# EAGLE schematic controller-c0m0 (EAGLE 9.0.0)

## Sheet 1 of 2
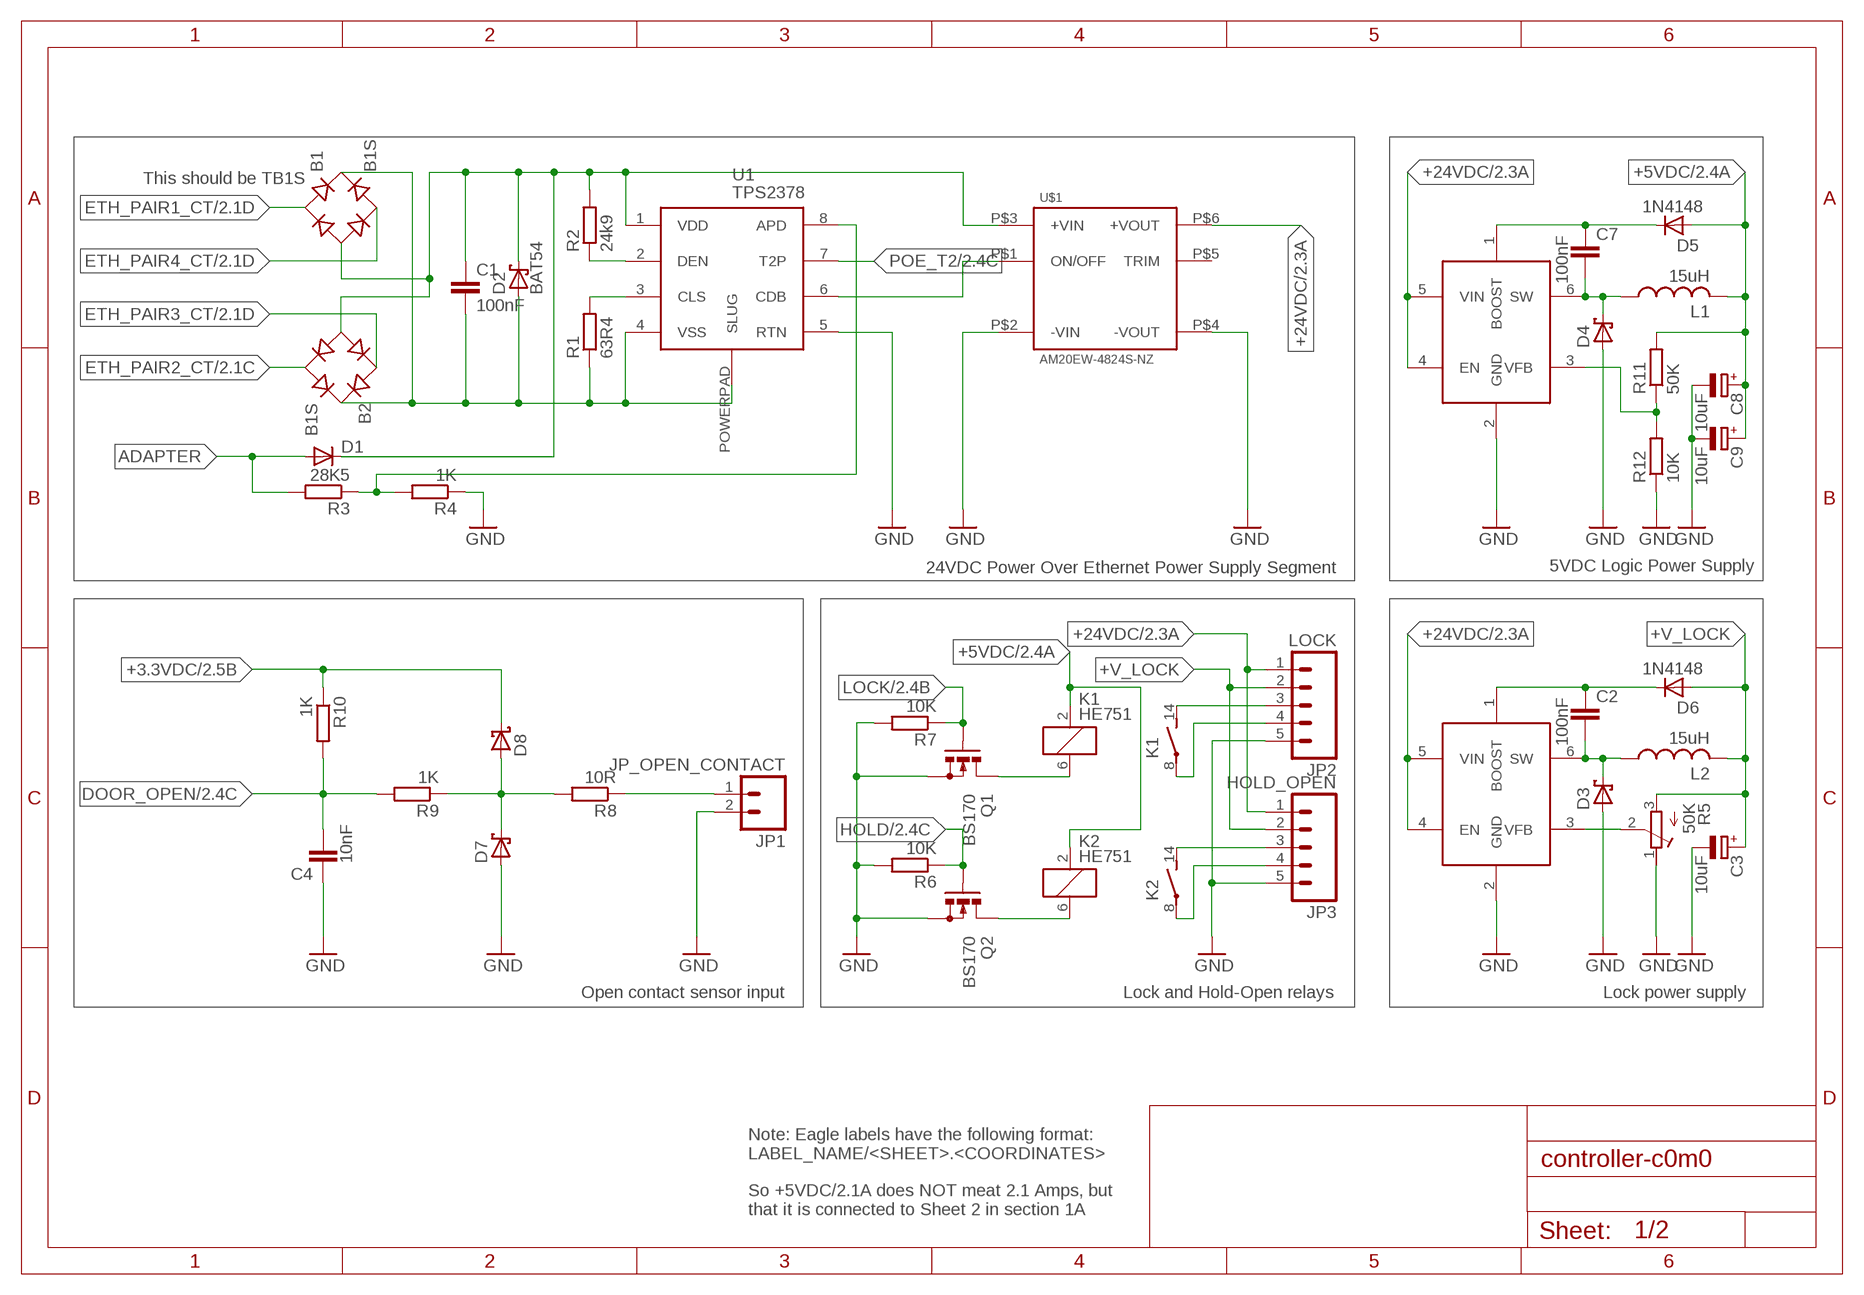
[diagram p0: schematic, sheet 1]

### Parts
B1  B1S  [MBS]
B2  B1S  [MBS]
C1  100nF  C  [C0805]
C2  100nF  C-EUC0805  [C0805]
C3  10uF  CPOL-EUA/3216-18R  [A/3216-18R]
C4  10nF  C-EUC0805  [C0805]
C7  100nF  C-EUC0805  [C0805]
C8  10uF  CPOL-EUA/3216-18R  [A/3216-18R]
C9  10uF  CPOL-EUA/3216-18R  [A/3216-18R]
D1  DIODE-SOD323-W  [SOD323-W]
D2  BAT54  [SOT23]
D3  BAT60J  [SOD323_ST]
D4  BAT60J  [SOD323_ST]
D5  1N4148  DIODE-SOD323-W  [SOD323-W]
D6  1N4148  DIODE-SOD323-W  [SOD323-W]
D7  BAT60J  [SOD323_ST]
D8  BAT60J  [SOD323_ST]
IC1  MCP16301/H  [SOT23-6]
IC3  MCP16301/H  [SOT23-6]
JP1  JP_OPEN_CONTACT  M02LOCK_LONGPADS  [1X02_LOCK_LONGPADS]
JP2  LOCK  M05PTH_LONGPADS  [1X05_LONGPADS]
JP3  HOLD_OPEN  M05PTH_LONGPADS  [1X05_LONGPADS]
K1  HE751  [HE751]
K2  HE751  [HE751]
L1  15uH  L-USPIS2816  [PIS2816]
L2  15uH  L-USPIS2816  [PIS2816]
Q1  BS170  [SOT54E]
Q2  BS170  [SOT54E]
R1  63R4  R  [R0805]
R2  24k9  R  [R0805]
R3  28K5  R  [R0805]
R4  1K  R  [R0805]
R5  50K  R-TRIMM3314G  [RTRIM3314G]
R6  10K  R  [R0805]
R7  10K  R  [R0805]
R8  10R  R-EU_R0805  [R0805]
R9  1K  R-EU_R0805  [R0805]
R10  1K  R-EU_R0805  [R0805]
R11  50K  R-EU_R0805  [R0805]
R12  10K  R-EU_R0805  [R0805]
U1  TPS2378  [SO08-POWERPAD]
U$1  AM20EW-4824S-NZ  [AM20NW-NZ]

### Nets
+3.3VDC: D8.C R10.1 ; also sheet 2
+5VDC: C8.+ C9.+ D5.A K1.2 K2.2 L1.2 R11.2 ; also sheet 2
+24VDC: IC1.4(EN) IC1.5(VIN) IC3.4(EN) IC3.5(VIN) JP2.1 JP3.1 U$1.P$6(+VOUT) ; also sheet 2
+V_LOCK: C3.+ D6.A JP2.2 JP3.2 L2.2 R5.3(A)
ADAPTER: D1.A R3.2
DOOR_OPEN: C4.2 R9.2 R10.2 ; also sheet 2
ETH_PAIR1_CT: B1.AC1 ; also sheet 2
ETH_PAIR2_CT: B2.AC2 ; also sheet 2
ETH_PAIR3_CT: B2.AC1 ; also sheet 2
ETH_PAIR4_CT: B1.AC2 ; also sheet 2
GND: C3.- C4.1 C8.- C9.- D3.A D4.A D7.A IC1.2(GND) IC3.2(GND) JP1.2 JP2.5 JP3.5 Q1.S Q2.S R4.1 R5.1(E) R6.2 R7.2 R12.1 U1.5(RTN) U$1.P$2(-VIN) U$1.P$4(-VOUT) ; also sheet 2
HOLD: Q2.G R6.1 ; also sheet 2
LOCK: Q1.G R7.1 ; also sheet 2
N$1: R1.2 U1.3(CLS)
N$2: R2.1 U1.2(DEN)
N$3: U1.6(CDB) U$1.P$1(ON/OFF)
N$4: C2.2 D3.C IC1.6(SW) L2.1
N$5: R3.1 R4.2 U1.8(APD)
N$6: C2.1 D6.C IC1.1(BOOST)
N$7: IC1.3(VFB) R5.2(S)
N$8: JP2.3 K1.14(2:S)
N$9: JP2.4 K1.8(2:P)
N$10: JP3.3 K2.14(2:S)
N$11: JP3.4 K2.8(2:P)
N$12: K1.6 Q1.D
N$13: K2.6 Q2.D
N$14: D7.C D8.A R8.2 R9.1
N$16: JP1.1 R8.1
N$22: C7.2 D4.C IC3.6(SW) L1.1
N$23: C7.1 D5.C IC3.1(BOOST)
N$25: IC3.3(VFB) R11.1 R12.2
POE_T2: U1.7(T2P) ; also sheet 2
V+_POE: B1.- B2.- C1.1 D1.C D2.3(C) R2.2 U1.1(VDD) U$1.P$3(+VIN)
V-_POE: B1.+ B2.+ C1.2 D2.1(A) R1.1 U1.4(VSS) U1.POWERPAD(SLUG)
Unconnected: U$1.P$5(TRIM)

### Notes on the sheet
- This should be TB1S
- 24VDC Power Over Ethernet Power Supply Segment | 5VDC Logic Power Supply
- Open contact sensor input | Lock and Hold-Open relays | Lock power supply
- Note: Eagle labels have the following format:
  LABEL_NAME/<SHEET>.<COORDINATES>
  
  So +5VDC/2.1A does NOT meat 2.1 Amps, but
  that it is connected to Sheet 2 in section 1A

## Sheet 2 of 2
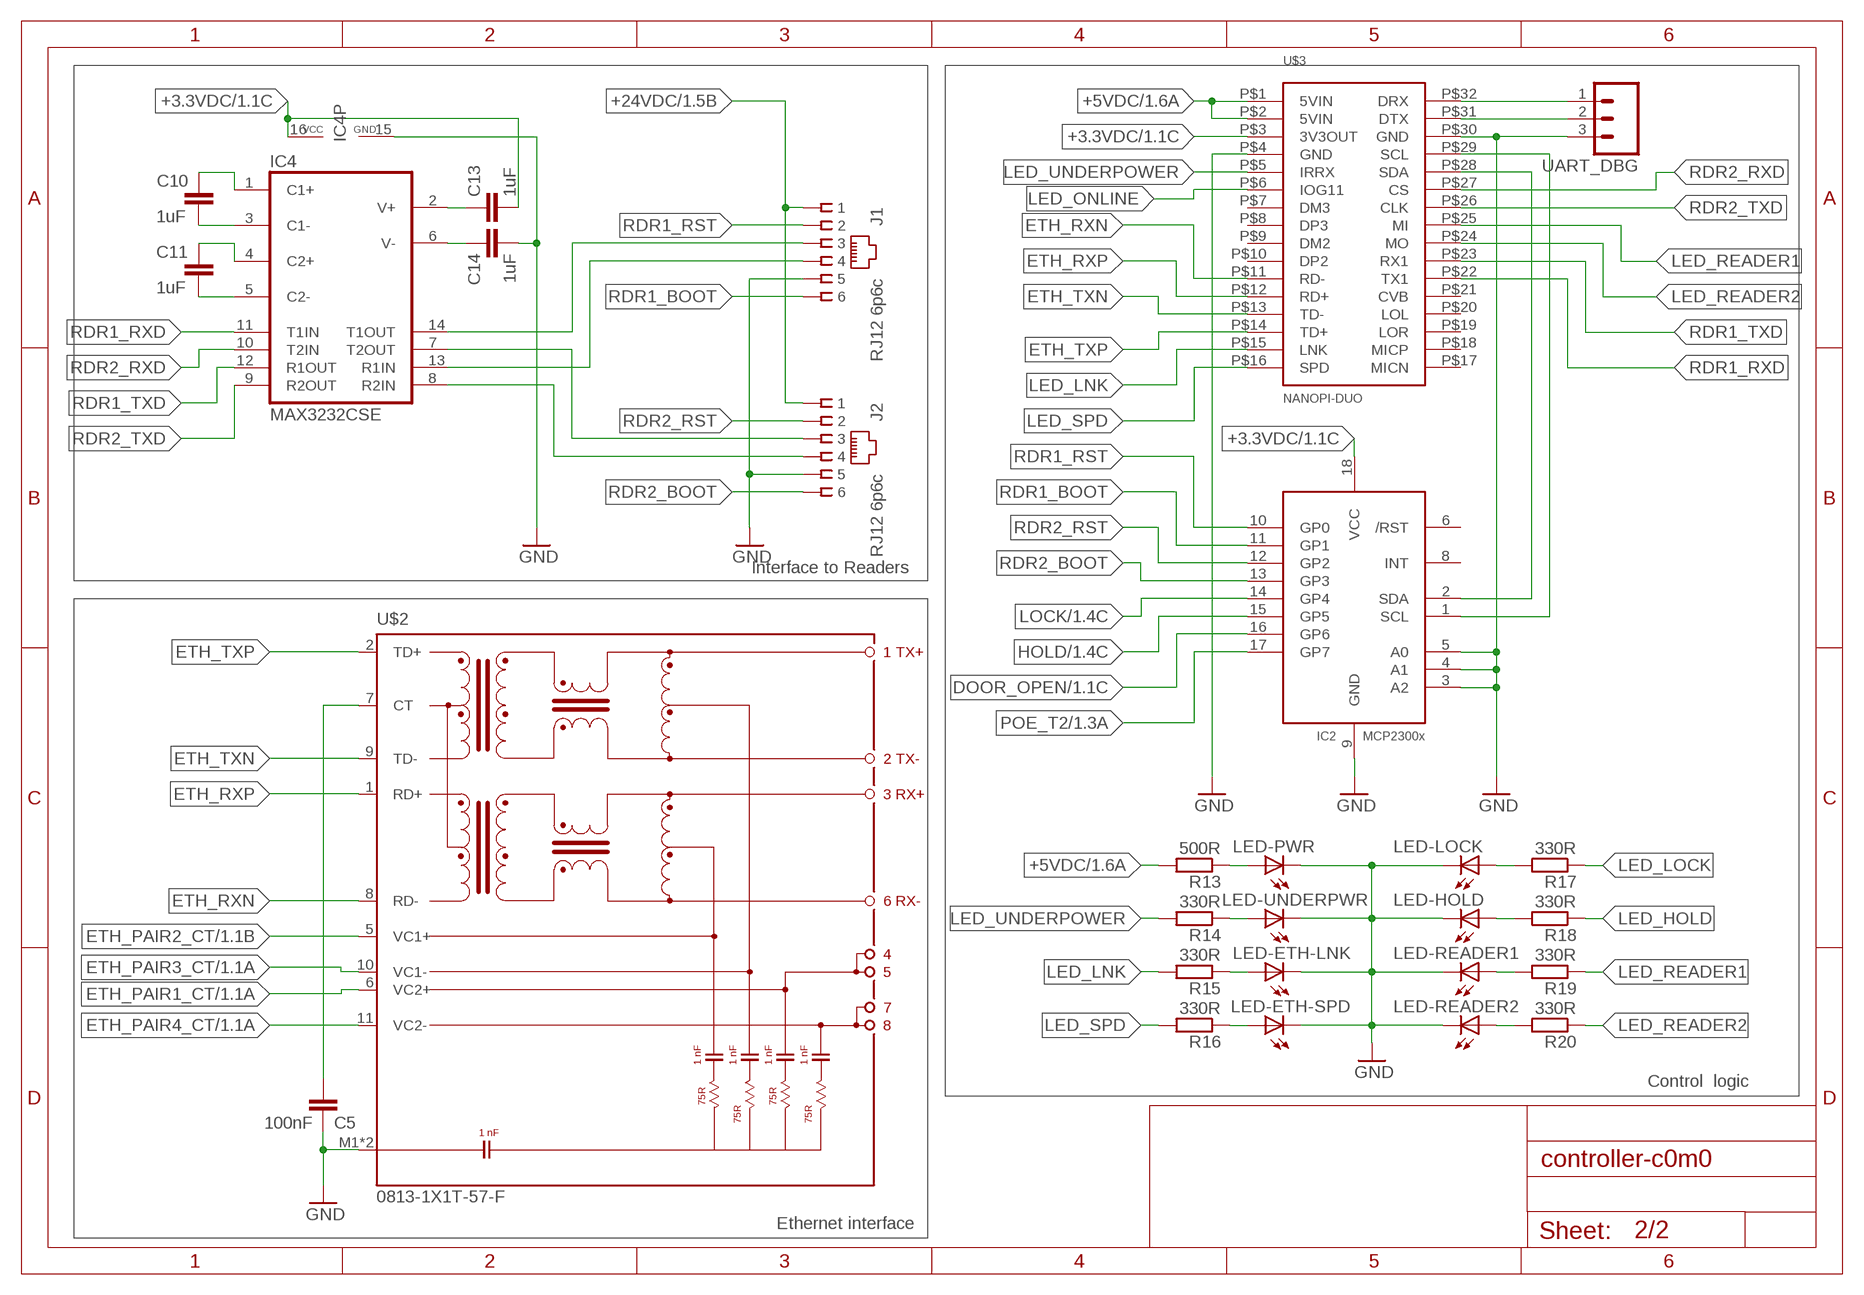
[diagram p1: schematic, sheet 2]

### Parts
C5  100nF  C-EUC0805  [C0805]
C10  1uF  C-EUC0805  [C0805]
C11  1uF  C-EUC0805  [C0805]
C13  1uF  C-EUC0805  [C0805]
C14  1uF  C-EUC0805  [C0805]
IC2  MCP23008/SO  [SO18W]
IC4  MAX3232CSE  [SO16]
J1  RJ12 6p6c  RJ11-2X  [RJ11-NO_SHIELD]
J2  RJ12 6p6c  RJ11-2X  [RJ11-NO_SHIELD]
LED-ETH-LNK  LEDCHIP-LED0805  [CHIP-LED0805]
LED-ETH-SPD  LEDCHIP-LED0805  [CHIP-LED0805]
LED-HOLD  LEDCHIP-LED0805  [CHIP-LED0805]
LED-LOCK  LEDCHIP-LED0805  [CHIP-LED0805]
LED-PWR  LEDCHIP-LED0805  [CHIP-LED0805]
LED-READER1  LEDCHIP-LED0805  [CHIP-LED0805]
LED-READER2  LEDCHIP-LED0805  [CHIP-LED0805]
LED-UNDERPWR  LEDCHIP-LED0805  [CHIP-LED0805]
R13  500R  R  [R0805]
R14  330R  R  [R0805]
R15  330R  R  [R0805]
R16  330R  R  [R0805]
R17  330R  R  [R0805]
R18  330R  R  [R0805]
R19  330R  R  [R0805]
R20  330R  R  [R0805]
U$2  0813-1X1T-57-F  [J1]
U$3  NANOPI-DUO  [NANOPI-DUO]
UART_DBG  M03LONGPADS  [1X03_LONGPADS]

### Nets
+3.3VDC: C13.2 IC2.18(VCC) IC4.16(VCC) U$3.P$3(3V3OUT) ; also sheet 1
+5VDC: R13.2 U$3.P$1(5VIN) U$3.P$2(5VIN) ; also sheet 1
+24VDC: J1.1 J2.1 ; also sheet 1
DOOR_OPEN: IC2.16(GP6) ; also sheet 1
ETH_PAIR1_CT: U$2.6(VC2+) ; also sheet 1
ETH_PAIR2_CT: U$2.5(VC1+) ; also sheet 1
ETH_PAIR3_CT: U$2.10(VC1-) ; also sheet 1
ETH_PAIR4_CT: U$2.11(VC2-) ; also sheet 1
ETH_RXN: U$2.8(RD-) U$3.P$11(RD-)
ETH_RXP: U$2.1(RD+) U$3.P$12(RD+)
ETH_TXN: U$2.9(TD-) U$3.P$13(TD-)
ETH_TXP: U$2.2(TD+) U$3.P$14(TD+)
GND: C5.1 C14.2 IC2.3(A2) IC2.4(A1) IC2.5(A0) IC2.9(GND) IC4.15(GND) J1.5 J2.5 LED-ETH-LNK.C LED-ETH-SPD.C LED-HOLD.C LED-LOCK.C LED-PWR.C LED-READER1.C LED-READER2.C LED-UNDERPWR.C U$2.M1 U$2.M2 U$3.P$4(GND) U$3.P$30(GND) UART_DBG.3 ; also sheet 1
HOLD: IC2.15(GP5) ; also sheet 1
LED_HOLD: R18.1
LED_LNK: R15.2 U$3.P$15(LNK)
LED_LOCK: R17.1
LED_ONLINE: U$3.P$6(IOG11)
LED_READER1: R19.1 U$3.P$25(MI)
LED_READER2: R20.1 U$3.P$24(MO)
LED_SPD: R16.2 U$3.P$16(SPD)
LED_UNDERPOWER: R14.2 U$3.P$5(IRRX)
LOCK: IC2.14(GP4) ; also sheet 1
N$15: IC4.14(T1OUT) J1.3
N$17: IC4.13(R1IN) J1.4
N$18: C10.1 IC4.1(C1+)
N$19: C10.2 IC4.3(C1-)
N$20: C11.1 IC4.4(C2+)
N$21: C11.2 IC4.5(C2-)
N$24: C13.1 IC4.2(V+)
N$26: C14.1 IC4.6(V-)
N$27: IC4.7(T2OUT) J2.3
N$28: C5.2 U$2.7(CT)
N$29: IC4.8(R2IN) J2.4
N$30: IC2.2(SDA) U$3.P$28(SDA)
N$31: IC2.1(SCL) U$3.P$29(SCL)
N$33: U$3.P$31(DTX) UART_DBG.2
N$34: U$3.P$32(DRX) UART_DBG.1
N$38: LED-PWR.A R13.1
N$39: LED-UNDERPWR.A R14.1
N$40: LED-ETH-LNK.A R15.1
N$41: LED-ETH-SPD.A R16.1
N$42: LED-LOCK.A R17.2
N$43: LED-HOLD.A R18.2
N$44: LED-READER1.A R19.2
N$45: LED-READER2.A R20.2
POE_T2: IC2.17(GP7) ; also sheet 1
RDR1_BOOT: IC2.11(GP1) J1.6
RDR1_RST: IC2.10(GP0) J1.2
RDR1_RXD: IC4.11(T1IN) U$3.P$22(TX1)
RDR1_TXD: IC4.12(R1OUT) U$3.P$23(RX1)
RDR2_BOOT: IC2.13(GP3) J2.6
RDR2_RST: IC2.12(GP2) J2.2
RDR2_RXD: IC4.10(T2IN) U$3.P$27(CS)
RDR2_TXD: IC4.9(R2OUT) U$3.P$26(CLK)
Unconnected: IC2.6(/RST) IC2.8(INT) U$3.P$7(DM3) U$3.P$8(DP3) U$3.P$9(DM2) U$3.P$10(DP2) U$3.P$17(MICN) U$3.P$18(MICP) U$3.P$19(LOR) U$3.P$20(LOL) U$3.P$21(CVB)

### Notes on the sheet
- Interface to Readers
- Control  logic
- Ethernet interface

## Library data of the parts
B1 B2 = rectifier:B*S: Surface Mount Glass Passivated Bridge Rectifiers Source: Comchip Bridge Rectifiers B05S-G_B10S-G.pdf
C1 = eagle-ltspice:C: CAPACITOR, European symbol; SPICEMODEL: NONE; SPICEPREFIX: C
C2 C4 C5 C7 C10 C11 C13 C14 = rcl:C-EU: CAPACITOR, European symbol
C3 C8 C9 = rcl:CPOL-EU: POLARIZED CAPACITOR, European symbol
D1 D5 D6 = diode:DIODE-: DIODE
D2 = diode:BAT54: Schottky Diodes Source: Fairchild .. BAT54.pdf
D3 D4 D7 D8 = diode:BAT60J: Schottky barrier diode Source: www.st.com, BAT60J.pdf
IC1 IC3 = MCP16301:MCP16301/H: High-Voltage Input Integrated Switch Step-Down Regulator
IC2 = adafruit:MCP23008: MCP23008 Inexpensive i2c i/o expander - 8 general purpose i/o pins with optional pullups
IC4 = maxim:MAX3232*: True RS-232 Transceivers 3.0V to 5.5V, Low-Power up to 1Mbps, Using Four 0.1µF External Capacitors Source: http://pdfserv.maxim-ic.com/en/ds/MAX3222-MAX3241.pdf; MPN: MAX3232CSE; OC_FARNELL: 9725490; OC_NEWARK: 90C2890
J1 J2 = con-tycoelectronics:RJ11: CORCOM Modular RJ Jacks No Shield Source: www.tycoelectronics.com .. ENG_DS_1654001_1099_RJ_L_0507.pdf; OC_FARNELL: unknown; OC_NEWARK: unknown
JP1 = SparkFun:M02: Header 2 Standard 2-pin 0.1" header. Use with straight break away headers (SKU : PRT-00116), right angle break away headers (PRT-00553), swiss pins (PRT-00743), machine pins (PRT-00117), and female headers (PRT-00115). Molex polarized connector foot print use with SKU : PRT-08233 with associated crimp pins and housings.
JP2 JP3 = SparkFun:M05: Header 5 Standard 5-pin 0.1" header. Use with straight break away headers (SKU : PRT-00116), right angle break away headers (PRT-00553), swiss pins (PRT-00743), machine pins (PRT-00117), and female headers (PRT-00115). Molex polarized connector foot print use with SKU : PRT-08230 with associated crimp pins and housings.
K1 K2 = relay:HE751: RELAY reed, 1 x norm. open, Hamlin; OC_FARNELL: unknown; OC_NEWARK: unknown
L1 L2 = rcl:L-US: INDUCTOR, American symbol
LED-ETH-LNK LED-ETH-SPD LED-HOLD LED-LOCK LED-PWR LED-READER1 LED-READER2 LED-UNDERPWR = adafruit:LED: LED OSRAM: - CHIPLED LG R971, LG N971, LY N971, LG Q971, LY Q971, LO R971, LY R971 LH N974, LH R974 LS Q976, LO Q976, LY Q976 LO Q996 - Hyper CHIPLED LW Q18S LB Q993, LB Q99A, LB R99A - SideLED LS A670, LO A670, LY A670, LG A670, LP A670 LB A673, LV A673, LT A673, LW A673 LH A674 LY A675 LS A676, LA A676, LO A676, LY A676, LW A676 LS A679, LY A679, LG A679 - Hyper Micro SIDELED® LS Y876, LA Y876, LO Y876, LY Y876 LT Y87S - SmartLED LW L88C, LW L88S LB L89C, LB L89S, LG L890 LS L89K, LO L89K, LY L89K LS L896, LA L896, LO L896, LY L896 - TOPLED LS T670, LO T670, LY T670, LG T670, LP T670 LSG T670, LSP T670, LSY T670, LOP T670, LYG T670 LG T671, LOG T671, LSG T671 LB T673, LV T673, LT T673, LW T673 LH T674 LS T676, LA T676, LO T676, LY T676, LB T676, LH T676, LSB T676, LW T676 LB T67C, LV T67C, LT T67C, LS T67K, LO T67K, LY T67K, LW E67C LS E67B, LA E67B, LO E67B, LY E67B, LB E67C, LV E67C, LT E67C LW T67C LS T679, LY T679, LG T679 LS T770, LO T770, LY T770, LG T770, LP T770 LB T773, LV T773, LT T773, LW T773 LH T774 LS E675, LA E675, LY E675, LS T675 LS T776, LA T776, LO T776, LY T776, LB T776 LHGB T686 LT T68C, LB T68C - Hyper Mini TOPLED® LB M676 - Mini TOPLED Santana® LG M470 LS M47K, LO M47K, LY M47K Source: http://www.osram.convergy.de/
Q1 Q2 = transistor-small-signal:BS170: N-CHANNEL MOS FET
R1-R4 R6 R7 R13-R20 = eagle-ltspice:R: RESISTOR, European symbol; SPICEMODEL: NONE; SPICEPREFIX: R
R5 = resistor:R-TRIMM: Trimm resistor
R8-R12 = rcl:R-EU_: RESISTOR, European symbol
U1 = ELL-i-PowerIC:TPS2378: TI 802.3at Power-over-Ethernet controller with an integrated FET This IC contains all of the features needed to implement an IEEE802.3at type-2 powered device (PD). It includes an 0.5 Ω RDSON Power FET, which enables continuous 0.85 A current. It supports also auxiliary power. Product page <http://www.ti.com/product/tps2378> Datasheet <http://www.ti.com/lit/gpn/tps2378> Wiki page <https://github.com/Ell-i/ELL-i-Eagle-Libraries/wiki/PowerIC-TPS2378>
U$1 = AM20EW:AM20EW-4824S-NZ
U$2 = con-belfuse:0813-1X1T-57-F: 0813-1X1T-57-F Power over Ethernet Single Port MagJack® 1CT : 1XT +- 2% 350uH MIN.
U$3 = FriendlyARM:NANOPI-DUO: http://wiki.friendlyarm.com/wiki/index.php/NanoPi_Duo
UART_DBG = SparkFun:M03: Header 3 Standard 3-pin 0.1" header. Use with straight break away headers (SKU : PRT-00116), right angle break away headers (PRT-00553), swiss pins (PRT-00743), machine pins (PRT-00117), and female headers (PRT-00115). Molex polarized connector foot print use with SKU : PRT-08232 with associated crimp pins and housings.